# EAGLE design StarLiteMain (EAGLE 9.6.0)
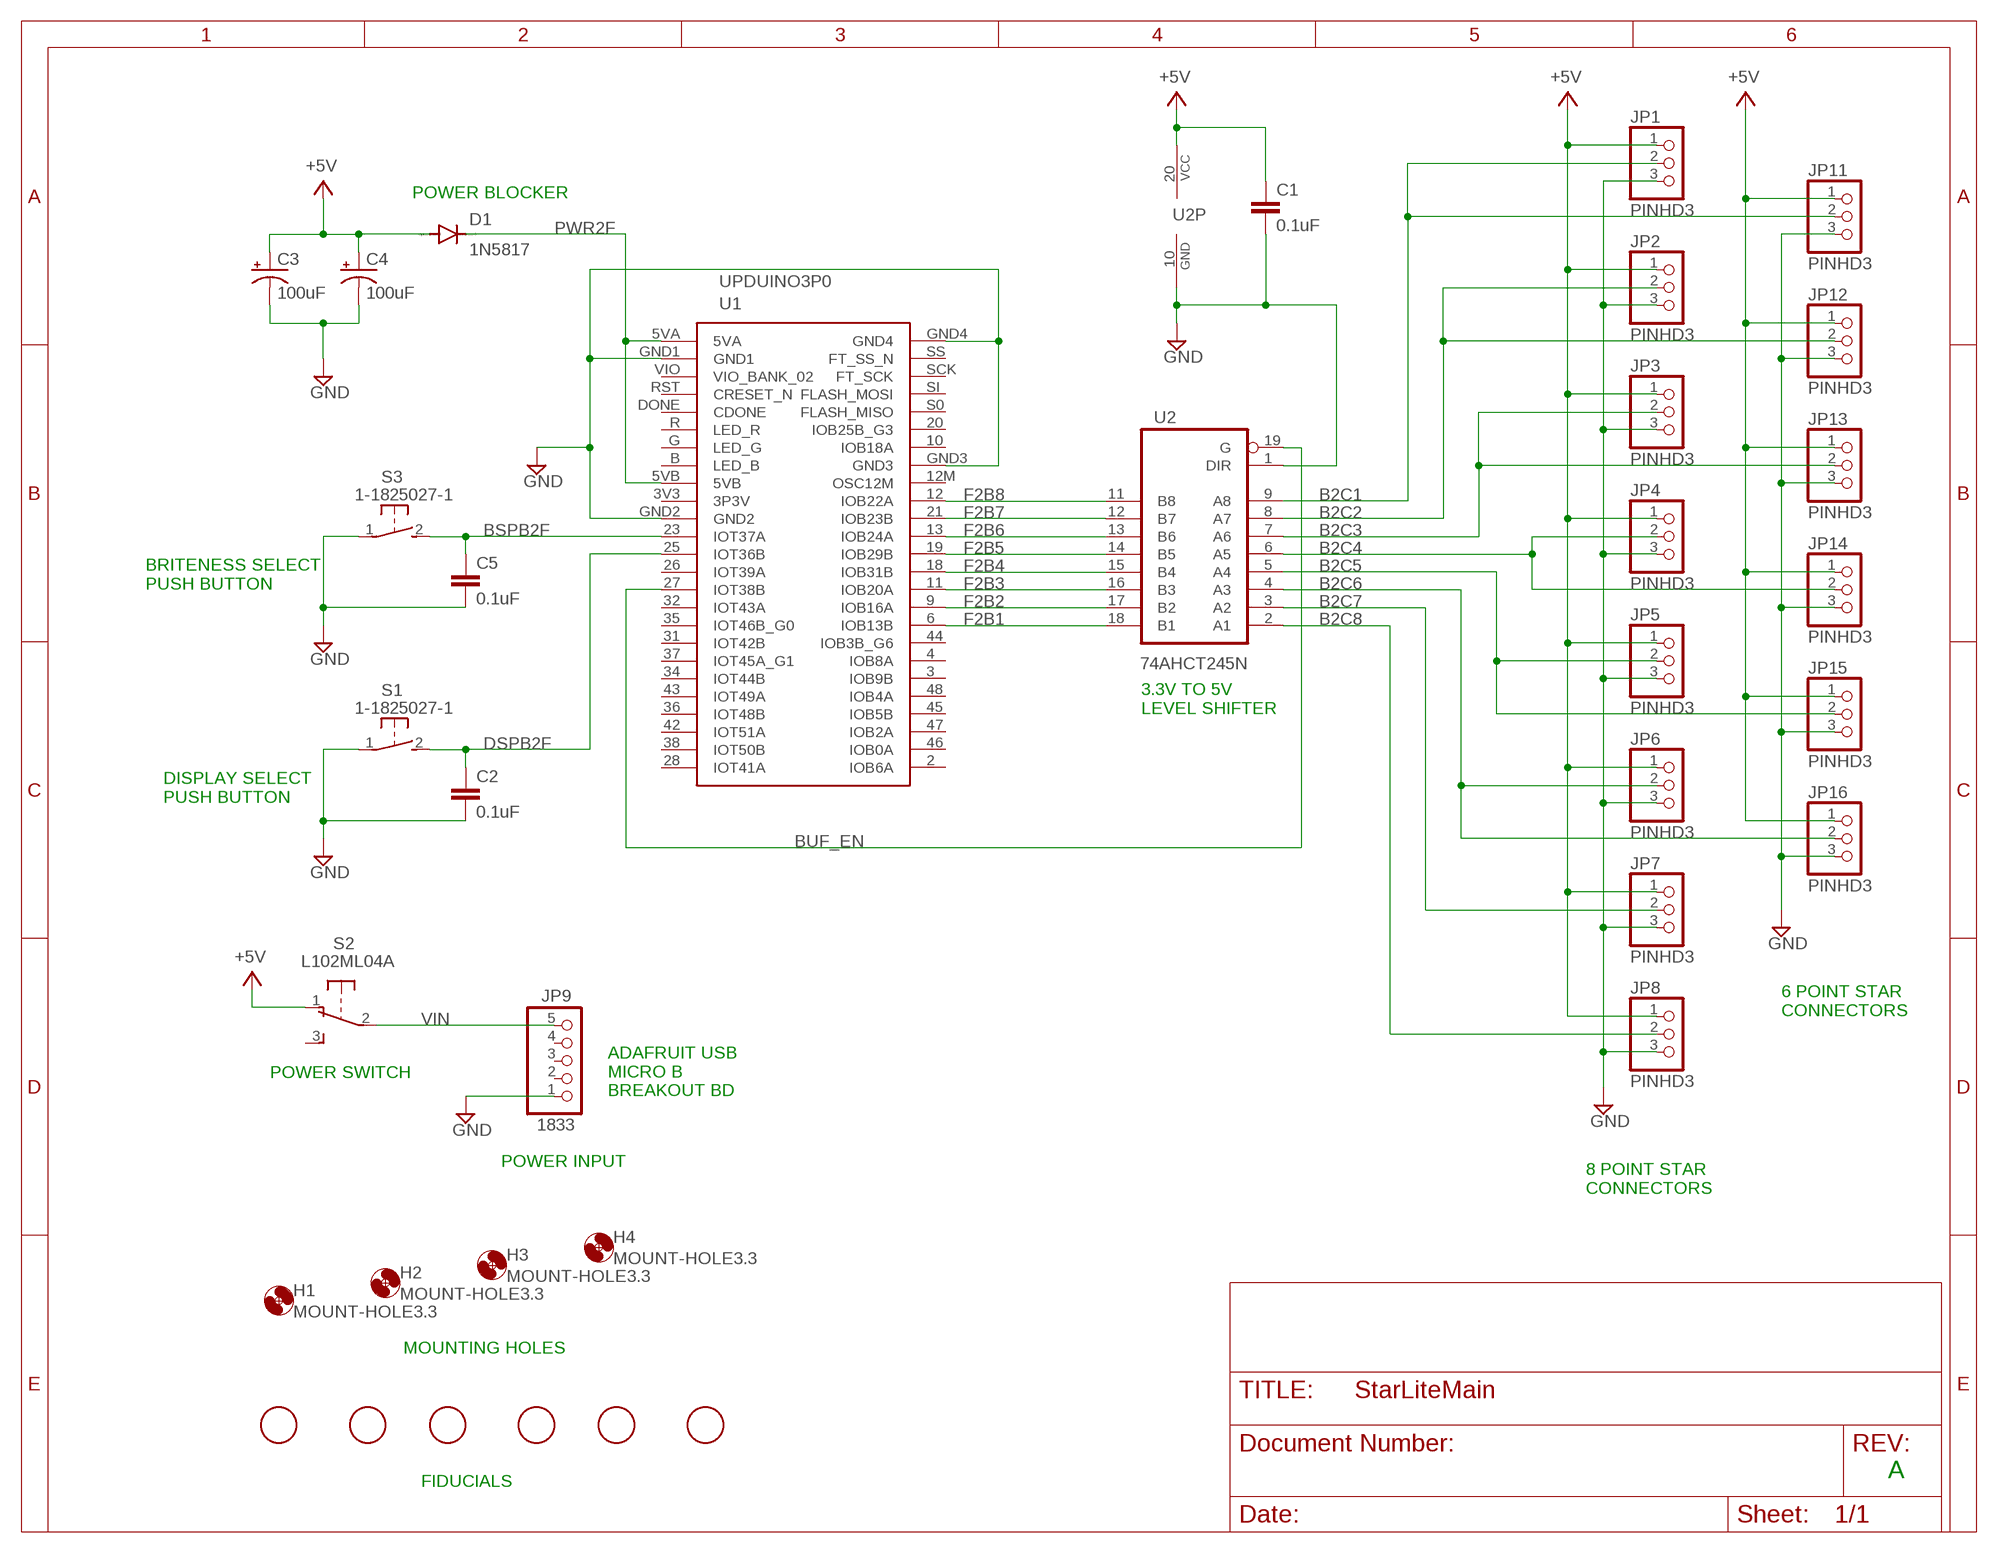
[diagram p0: schematic, sheet 1]

## Parts
C1  0.1uF  C2,5-3  [C2.5-3]
C2  0.1uF  C2,5-3  [C2.5-3]
C3  100uF  CPOL-USE2.5-6  [E2,5-6]
C4  100uF  CPOL-USE2.5-6  [E2,5-6]
C5  0.1uF  C2,5-3  [C2.5-3]
D1  1N5817  DIODE-DO41-10  [DO41-10]
H1  MOUNT-HOLE3.3  [3,3]
H2  MOUNT-HOLE3.3  [3,3]
H3  MOUNT-HOLE3.3  [3,3]
H4  MOUNT-HOLE3.3  [3,3]
JP1  PINHD3  PINHD-1X31X03_50  [1X03_50MIL]
JP2  PINHD3  PINHD-1X31X03_50  [1X03_50MIL]
JP3  PINHD3  PINHD-1X31X03_50  [1X03_50MIL]
JP4  PINHD3  PINHD-1X31X03_50  [1X03_50MIL]
JP5  PINHD3  PINHD-1X31X03_50  [1X03_50MIL]
JP6  PINHD3  PINHD-1X31X03_50  [1X03_50MIL]
JP7  PINHD3  PINHD-1X31X03_50  [1X03_50MIL]
JP8  PINHD3  PINHD-1X31X03_50  [1X03_50MIL]
JP9  1833  PINHD-1X5  [1X05]
JP11  PINHD3  PINHD-1X31X03_50  [1X03_50MIL]
JP12  PINHD3  PINHD-1X31X03_50  [1X03_50MIL]
JP13  PINHD3  PINHD-1X31X03_50  [1X03_50MIL]
JP14  PINHD3  PINHD-1X31X03_50  [1X03_50MIL]
JP15  PINHD3  PINHD-1X31X03_50  [1X03_50MIL]
JP16  PINHD3  PINHD-1X31X03_50  [1X03_50MIL]
S1  1-1825027-1  31-XX  [B3F-31XX]
S2  L102ML04A  [SPDT187]
S3  1-1825027-1  31-XX  [B3F-31XX]
U1  UPDUINO3P0  [UPDUINO3P0]
U2  74AHCT245N  [DIL20]
U$1  FIDUCIAL  [FIDUCIAL_1MM]
U$2  FIDUCIAL  [FIDUCIAL_1MM]
U$3  FIDUCIAL  [FIDUCIAL_1MM]
U$4  FIDUCIAL  [FIDUCIAL_1MM]
U$5  FIDUCIAL  [FIDUCIAL_1MM]
U$6  FIDUCIAL  [FIDUCIAL_1MM]

## Nets
+5V: C1.1 C3.+ C4.+ D1.A JP1.1 JP2.1 JP3.1 JP4.1 JP5.1 JP6.1 JP7.1 JP8.1 JP11.1 JP12.1 JP13.1 JP14.1 JP15.1 JP16.1 S2.1(O) U2.20(VCC)
B2C1: JP1.2 JP11.2 U2.9(A8)
B2C2: JP2.2 JP12.2 U2.8(A7)
B2C3: JP3.2 JP13.2 U2.7(A6)
B2C4: JP4.2 JP14.2 U2.6(A5)
B2C5: JP5.2 JP15.2 U2.5(A4)
B2C6: JP6.2 JP16.2 U2.4(A3)
B2C7: JP7.2 U2.3(A2)
B2C8: JP8.2 U2.2(A1)
BSPB2F: C5.1 S3.2(S) U1.23(IOT37A)
BUF_EN: U1.27(IOT38B) U2.19(G)
DSPB2F: C2.1 S1.2(S) U1.25(IOT36B)
F2B1: U1.6(IOB13B) U2.18(B1)
F2B2: U1.9(IOB16A) U2.17(B2)
F2B3: U1.11(IOB20A) U2.16(B3)
F2B4: U1.18(IOB31B) U2.15(B4)
F2B5: U1.19(IOB29B) U2.14(B5)
F2B6: U1.13(IOB24A) U2.13(B6)
F2B7: U1.21(IOB23B) U2.12(B7)
F2B8: U1.12(IOB22A) U2.11(B8)
GND: C1.2 C2.2 C3.- C4.- C5.2 JP1.3 JP2.3 JP3.3 JP4.3 JP5.3 JP6.3 JP7.3 JP8.3 JP9.1 JP11.3 JP12.3 JP13.3 JP14.3 JP15.3 JP16.3 S1.1(P) S3.1(P) U1.GND1 U1.GND2 U1.GND3 U1.GND4 U2.1(DIR) U2.10(GND)
PWR2F: D1.C U1.5VA U1.5VB
VIN: JP9.5 S2.2(P)
Unconnected: JP9.2 JP9.3 JP9.4 S2.3(S) U1.2(IOB6A) U1.3(IOB9B) U1.3V3(3P3V) U1.4(IOB8A) U1.10(IOB18A) U1.12M(OSC12M) U1.20(IOB25B_G3) U1.26(IOT39A) U1.28(IOT41A) U1.31(IOT42B) U1.32(IOT43A) U1.34(IOT44B) U1.35(IOT46B_G0) U1.36(IOT48B) U1.37(IOT45A_G1) U1.38(IOT50B) U1.42(IOT51A) U1.43(IOT49A) U1.44(IOB3B_G6) U1.45(IOB5B) U1.46(IOB0A) U1.47(IOB2A) U1.48(IOB4A) U1.B(LED_B) U1.DONE(CDONE) U1.G(LED_G) U1.R(LED_R) U1.RST(CRESET_N) U1.S0(FLASH_MISO) U1.SCK(FT_SCK) U1.SI(FLASH_MOSI) U1.SS(FT_SS_N) U1.VIO(VIO_BANK_02)

## Notes on the sheet
- POWER BLOCKER
- BRITENESS SELECT
  PUSH BUTTON
- 3.3V TO 5V
  LEVEL SHIFTER
- DISPLAY SELECT
  PUSH BUTTON
- 6 POINT STAR
  CONNECTORS
- POWER SWITCH
- ADAFRUIT USB 
  MICRO B
  BREAKOUT BD
- POWER INPUT
- 8 POINT STAR
  CONNECTORS
- MOUNTING HOLES
- A
- FIDUCIALS

## Library data of the parts
C1 C2 C5 = capacitor-wima:C: CAPACITOR naming: grid - package width
C3 C4 = rcl:CPOL-US: POLARIZED CAPACITOR, American symbol; SPICEPREFIX: C
D1 = StarLiteLib:DIODE-: DIODE
H1-H4 = holes:MOUNT-HOLE: MOUNTING HOLE with drill center marker
JP1-JP8 JP11-JP16 = StarLiteLib:PINHD-1X3: PIN HEADER
JP9 = pinhead:PINHD-1X5: PIN HEADER
S1 S3 = StarLiteLib:31-XX: OMRON SWITCH; MPN: B3F-3100; OC_FARNELL: 959704; OC_NEWARK: 36M3582
S2 = StarLiteLib:L102ML04A: SWITCH-SPDT
U1 = StarLiteLib:UPDUINO3P0: UPduino v3.0 Board
U2 = StarLiteLib:74*245: Octal BUS TRANSCEIVER, 3-state
U$1-U$6 = adafruit:FIDUCIAL: For use by pick and place machines to calibrate the vision/machine, 1mm By microbuilder.eu

## Net classes
0 default: clearance 0.205 mm

## Board
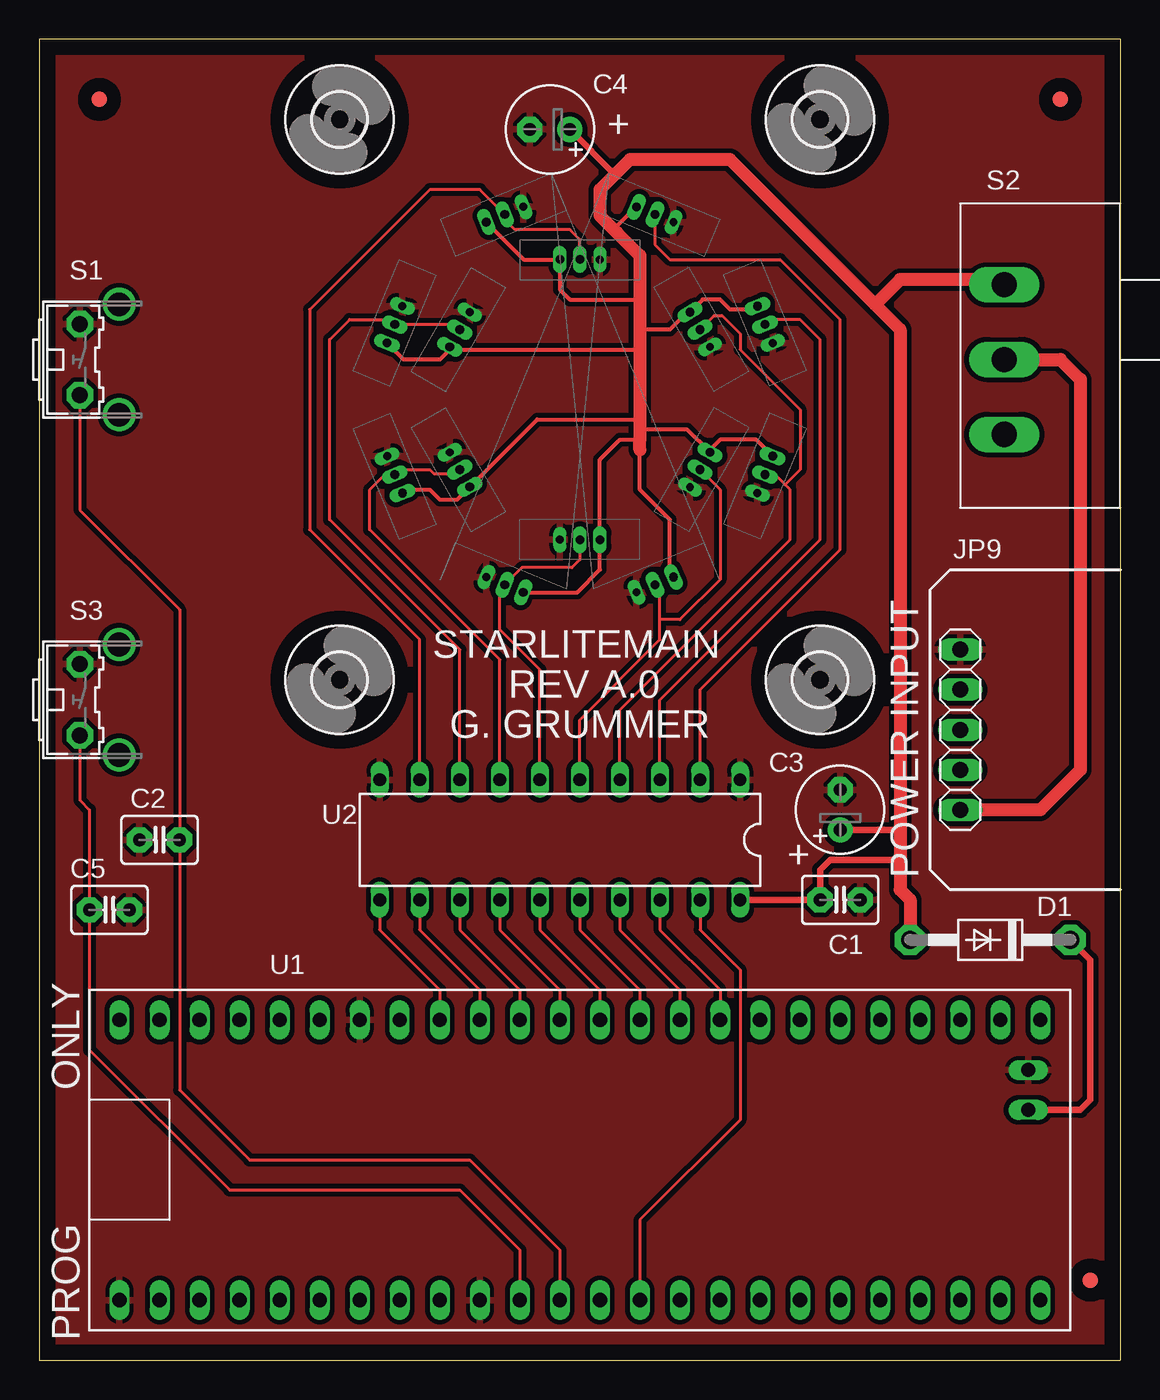
[diagram p1: board, top side]
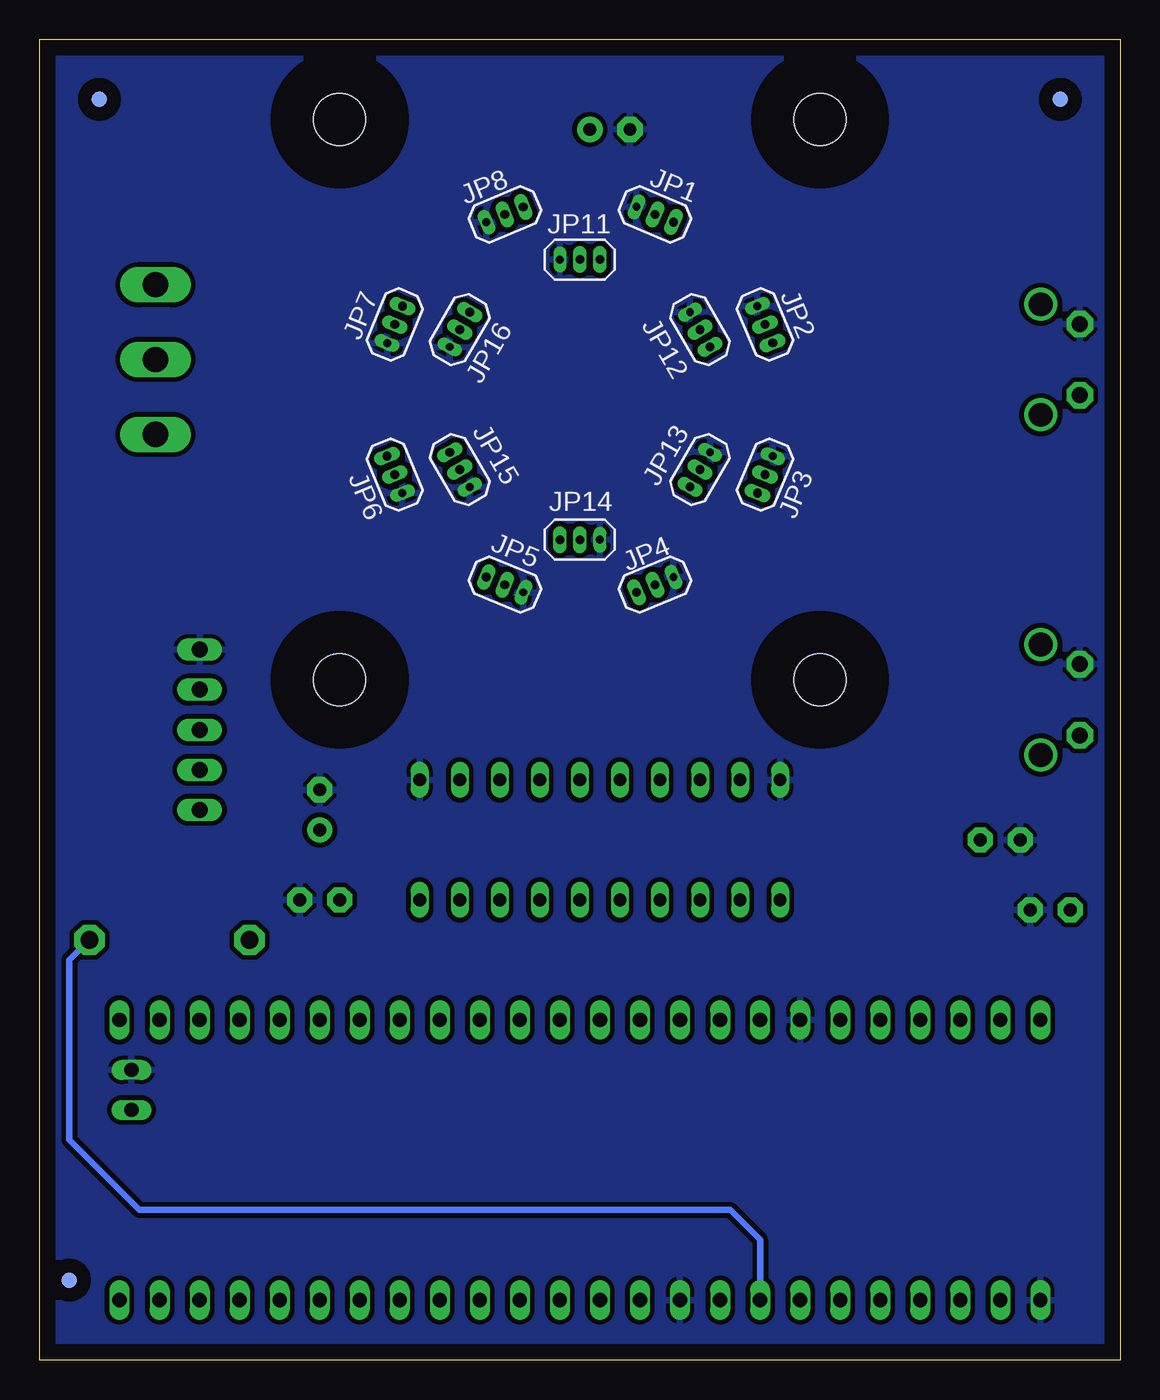
[diagram p2: board, bottom side, seen from below]

Size 68.58 x 83.82 mm. Coordinates in mm from the lower left corner, seen from the top.
Outline: 68.58,83.82 0,83.82 0,0 68.58,0 68.58,83.82
Copper layers (1*16): Top 0.035mm / dielectric 1.5mm / Bottom 0.035mm
Design rules "default *": minimum track width 6mil, minimum drill 0.35mm, track to track 6mil, track to pad 6mil, pad to pad 6mil, via to via 6mil, smd to smd 6mil, copper to edge 40mil, drill to drill 6mil, minimum pad ring 6mil, minimum via ring 8mil, stop-mask expansion 4mil, vias tented up to drill 0mil, thermal gap 10mil

### Footprints (pad centres in the part's own frame; a part is rotated, then mirrored left to right if it is on the bottom)
C2.5-3 = drill 0.813 pad 1.6 octagon: 1 -1.27,0; 2 1.27,0
E2,5-6 = drill 0.813 pad 1.6: + -1.27,0 | drill 0.813 pad 1.6 octagon: - 1.27,0
DO41-10 = drill 1.118 pad 1.93 octagon: A 5.08,0; C -5.08,0
3,3 = hole 3.3: 0,0
1X03_50MIL = drill 0.55 pad 0.813 long: 1 -1.27,0; 2 0,0 | drill 0.5 pad 0.813 long: 3 1.27,0
1X05 = drill 1.016 long: 1 -5.08,0; 2 -2.54,0; 3 0,0; 4 2.54,0; 5 5.08,0
B3F-31XX = drill 1.016 pad 1.676 octagon: 1 -2.261,-1.245; 2 2.261,-1.245 | drill 1.499: 3 -3.505,1.245; 4 3.505,1.245
SPDT187 = drill 1.6 long: 1 -4.75,-1.016; 2 0,-1.016; 3 4.75,-1.016
UPDUINO3P0 = drill 0.9 long: 2 -24.13,-7.62; 3 -11.43,-7.62; 3V3 13.97,10.16; 4 -8.89,-7.62; 5VA -23.368,-1.905; 5VB 16.51,10.16; 6 -3.81,-7.62; 9 -1.27,-7.62; 10 21.59,-7.62; 11 1.27,-7.62; 12 13.97,-7.62; 12M 16.51,-7.62; 13 8.89,-7.62; 18 3.81,-7.62; 19 6.35,-7.62; 20 24.13,-7.62; 21 11.43,-7.62; 23 8.89,10.16; 25 6.35,10.16; 26 3.81,10.16; 27 1.27,10.16; 28 -24.13,10.16; 31 -6.35,10.16; 32 -1.27,10.16; 34 -11.43,10.16; 35 -3.81,10.16; 36 -16.51,10.16; 37 -8.89,10.16; 38 -21.59,10.16; 42 -19.05,10.16; 43 -13.97,10.16; 44 -6.35,-7.62; 45 -16.51,-7.62; 46 -21.59,-7.62; 47 -19.05,-7.62; 48 -13.97,-7.62; B 19.05,10.16; DONE 26.67,10.16; G 21.59,10.16; GND1 -23.368,-4.445; GND2 11.43,10.16; GND3 19.05,-7.62; GND4 34.29,10.16; R 24.13,10.16; RST 29.21,10.16; S0 26.67,-7.62; SCK 31.75,-7.62; SI 29.21,-7.62; SS 34.29,-7.62; VIO 31.75,10.16
DIL20 = drill 0.813 long: 1 -11.43,-3.81; 2 -8.89,-3.81; 3 -6.35,-3.81; 4 -3.81,-3.81; 5 -1.27,-3.81; 6 1.27,-3.81; 7 3.81,-3.81; 8 6.35,-3.81; 9 8.89,-3.81; 10 11.43,-3.81; 11 11.43,3.81; 12 8.89,3.81; 13 6.35,3.81; 14 3.81,3.81; 15 1.27,3.81; 16 -1.27,3.81; 17 -3.81,3.81; 18 -6.35,3.81; 19 -8.89,3.81; 20 -11.43,3.81
FIDUCIAL_1MM = smd 1 x 1: 1 0,0

### Placement (x,y rotation side)
C1  50.8,29.21 0 top
C2  7.62,33.02 180 top
C3  50.8,34.92 90 top
C4  32.38,78.11 180 top
C5  4.45,28.57 0 top
D1  60.33,26.67 180 top
H1  19.05,43.18 180 top
H2  49.53,43.18 180 top
H3  19.05,78.74 199.2 top
H4  49.53,78.74 180 top
JP1  29.53,72.71 157.5 bottom
JP2  22.54,65.72 112.5 bottom
JP3  22.54,56.2 67.5 bottom
JP4  29.53,49.21 22.5 bottom
JP5  39.05,49.21 337.5 bottom
JP6  46.04,56.2 292.5 bottom
JP7  46.04,65.72 247.5 bottom
JP8  39.05,72.71 202.5 bottom
JP9  58.42,40.01 270 top
JP11  34.29,69.85 180 bottom
JP12  26.67,65.41 120 bottom
JP13  26.67,56.52 60 bottom
JP14  34.29,52.07 0 bottom
JP15  41.91,56.52 300 bottom
JP16  41.91,65.41 240 bottom
S1  3.81,63.5 270 top
S2  62.23,63.5 270 top
S3  3.81,41.91 270 top
U1  39.37,13.97 180 top
U2  33.02,33.02 180 top
U$1  66.67,5.08 0 top
U$2  3.81,80.01 180 bottom
U$3  64.77,80.01 0 top
U$4  64.77,80.01 0 bottom
U$5  3.81,80.01 0 top
U$6  66.67,5.08 90 bottom

### Tracks (layer width: path | path; a pad name or v marks a point on that pad's centre or on a via)
+5V
  Top 0.203: JP16.1 41.1,66.5
  Top 0.254: JP2.1 23.11,63.5 25.4,63.5 26.04,64.14 JP12.1 26.2,64.14 38.1,64.14 | JP8.1 36.64,71.95 36.64,71.56 | JP1.1 30.73,69.85 JP11.1 33.02,67.94 33.66,67.31 38.1,67.31 | JP7.1 45.33,66.67 43.81,66.67 43.18,67.31 42.08,67.31 JP16.1 | 41.1,66.5 40.01,65.41 38.1,65.41 | JP3.1 23.25,55.24 24.77,55.24 25.4,54.61 26.5,54.61 JP13.1 31.58,59.69 38.1,59.69 | JP4.1 34.12,48.73 35.56,50.16 JP14.1 35.56,57.15 36.83,58.42 38.1,58.42 | JP5.1 40.01,49.92 40.01,53.34 38.1,55.24 38.1,57.78 | JP6.1 45.47,58.42 43.18,58.42 42.55,57.78 JP15.1 41.1,59.05 38.1,59.05
  Top 0.406: C4.+ 36.51,75.25 | C3.+ 54.61,33.66 | 54.61,31.75 50.16,31.75 49.53,31.11 C1.1 U2.20
  Top 0.813: 38.1,57.78 38.1,58.42 38.1,59.05 38.1,59.69 38.1,64.14 38.1,65.41 38.1,67.31 38.1,70.1 36.64,71.56 35.56,72.64 35.56,74.3 36.51,75.25 37.47,76.2 43.81,76.2 53.02,66.99 | 53.02,66.99 54.61,65.41 54.61,33.66 54.61,31.75 54.61,29.84 55.24,29.21 D1.A | S2.1 60.88,68.58 54.61,68.58 53.02,66.99
B2C1
  Top 0.203: U2.9 24.13,45.72 17.14,52.7 17.14,66.67 24.77,74.3 27.94,74.3 JP1.2 29.53,72.39 30.16,71.75 33.66,71.75 34.29,71.12 JP11.2
B2C2
  Top 0.203: 22.86,65.72 26.35,65.72 JP12.2 | 22.86,65.72 JP2.2 | U2.8 26.67,45.09 18.41,53.34 18.41,64.77 19.68,66.04 22.54,66.04 22.86,65.72
B2C3
  Top 0.203: U2.7 29.21,44.45 20.95,52.7 20.95,55.24 21.91,56.2 JP3.2 22.86,56.52 24.77,56.52 25.02,56.26 26.42,56.26 JP13.2
B2C4
  Top 0.203: U2.6 31.75,43.81 29.21,46.35 29.21,48.9 JP4.2 30.61,50.29 33.78,50.29 34.29,50.8 JP14.2
B2C5
  Top 0.203: U2.5 34.29,40.64 39.37,45.72 39.37,46.99 | 39.37,46.99 39.37,48.9 JP5.2 | JP15.2 43.18,55.24 43.18,49.53 40.64,46.99 39.37,46.99
B2C6
  Top 0.203: U2.4 36.83,41.27 47.62,52.07 47.62,55.24 47.31,55.56 | 47.31,55.56 46.67,56.2 JP6.2 | JP16.2 42.8,66.29 43.31,66.29 44.45,65.15 44.45,64.14 48.26,60.33 48.26,56.52 47.31,55.56
B2C7
  Top 0.203: JP7.2 46.35,66.04 48.26,66.04 49.53,64.77 49.53,52.07 39.37,41.91 U2.3
B2C8
  Top 0.203: U2.2 41.91,42.55 50.8,51.44 50.8,66.04 46.99,69.85 40.01,69.85 39.05,70.8 JP8.2
BSPB2F
  Top 0.203: S3.2 2.56,35.53 3.17,34.92 C5.1 3.17,19.68 12.06,10.79 26.67,10.79 30.48,6.99 U1.23
BUF_EN
  Top 0.203: U2.19 41.91,27.3 44.45,24.77 44.45,15.24 38.1,8.89 U1.27
DSPB2F
  Top 0.203: U1.25 33.02,6.99 27.3,12.7 13.34,12.7 8.89,17.14 C2.1 8.89,47.62 2.56,53.95 S1.2
F2B1
  Top 0.203: U2.18 39.37,27.3 43.18,23.5 U1.6
F2B2
  Top 0.203: U2.17 36.83,27.3 40.64,23.5 U1.9
F2B3
  Top 0.203: U2.16 34.29,27.3 38.1,23.5 U1.11
F2B4
  Top 0.203: U2.15 31.75,27.3 35.56,23.5 U1.18
F2B5
  Top 0.203: U2.14 29.21,27.3 33.02,23.5 U1.19
F2B6
  Top 0.203: U2.13 26.67,27.3 30.48,23.5 U1.13
F2B7
  Top 0.203: U2.12 24.13,27.3 27.94,23.5 U1.21
F2B8
  Top 0.203: U2.11 21.59,27.3 25.4,23.5 U1.12
GND
  pour Top (isolate 0.305): 0,0 0,83.82 68.58,83.82 68.58,0
  pour Bottom (isolate 0.305): 0,0 0,83.82 68.58,83.82 68.58,0
PWR2F
  Top 0.406: D1.C 66.67,25.4 66.67,16.51 66.04,15.88 U1.5VA
  Bottom 0.406: D1.C 66.67,25.4 66.67,13.97 62.23,9.53 24.77,9.53 22.86,7.62 U1.5VB
VIN
  Top 0.813: S2.2 64.77,63.5 66.04,62.23 66.04,37.47 63.5,34.92 JP9.5

### Text on the board
tPlace: + | POWER INPUT | STARLITEMAIN | REV A.0 | G. GRUMMER | + | ONLY | PROG